# EAGLE design P6 ESTACIONMETEOROLOGICA (EAGLE 7.3.0)
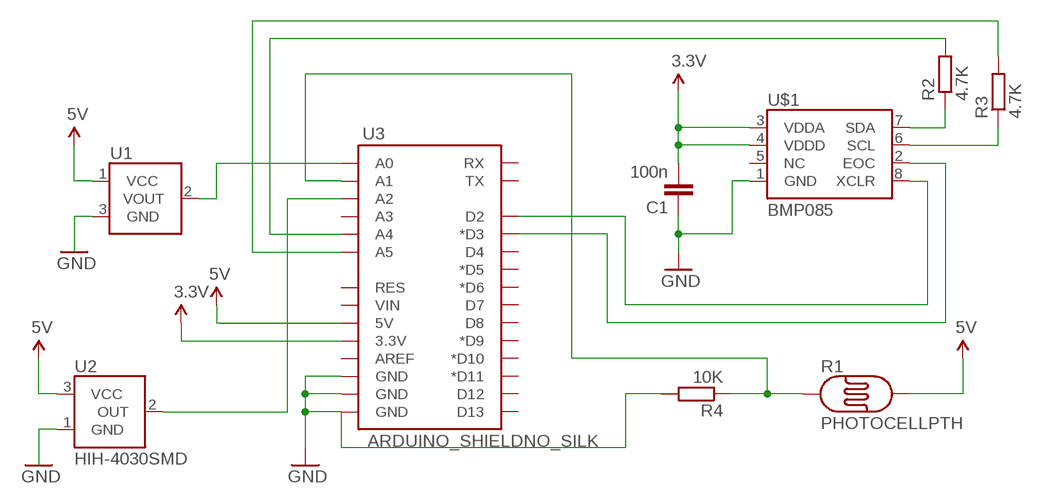
[diagram p0: schematic, sheet 1]

## Parts
C1  100n  C  [C0805]
R1  PHOTOCELLPTH  [PHOTOCELL]
R2  4.7K  R  [R0805]
R3  4.7K  R  [R0805]
R4  10K  R  [R0805]
U1  TMP36GT9  [TO-92]
U2  HIH-4030SMD  [HIH-4030]
U3  ARDUINO_SHIELDNO_SILK  [DUEMILANOVE_VIAS]
U$1  BMP085  [BMP085]

## Nets
3.3V: C1.2 U3.3.3V U$1.3(VDDA) U$1.4(VDDD)
5V: R1.2 U1.1(VCC) U2.3(VCC) U3.5V
GND: C1.1 U3.GND@0(GND) U3.GND@1(GND) U3.GND@2(GND) U$1.1(GND)
N$1: R2.1 U$1.7(SDA)
N$2: R2.2 U3.A4
N$3: R3.1 U$1.6(SCL)
N$4: R3.2 U3.A5
N$6: U3.D2 U$1.8(XCLR)
N$7: U3.D3(*D3) U$1.2(EOC)
N$8: R1.1 R4.1 U3.A1
N$9: U2.2(OUT) U3.A2
N$10: U2.1(GND)
N$11: U1.3(GND)
N$12: U1.2(VOUT) U3.A0
Unconnected: R4.2 U3.A3 U3.AREF U3.D4 U3.D5(*D5) U3.D6(*D6) U3.D7 U3.D8 U3.D9(*D9) U3.D10(*D10) U3.D11(*D11) U3.D12 U3.D13 U3.RES U3.RX U3.TX U3.VIN U$1.5(NC)

## Library data of the parts
C1 = eagle-ltspice:C: CAPACITOR, European symbol; SPICEMODEL: NONE; SPICEPREFIX: C
R1 = SparkFun-Sensors:PHOTOCELL: CdS photoresistor. This is a low cost way to detect light levels. Resistance decreases with more incoming light. SparkFun SKU: SEN-09088
R2-R4 = eagle-ltspice:R: RESISTOR, European symbol; SPICEMODEL: NONE; SPICEPREFIX: R
U1 = SparkFun-Sensors:TMP36: Precision degC temp sensor, analog out
U2 = SparkFun-Sensors:HIH-4030: Humidity Sensor
U3 = SparkFun-Boards:ARDUINO_SHIELD: Arduino shield footprint
U$1 = SparkFun-Sensors:BMP085: BMP085 Pressure Sensor Great little MEMS pressure sensor. SKU: COM-09603

## Board
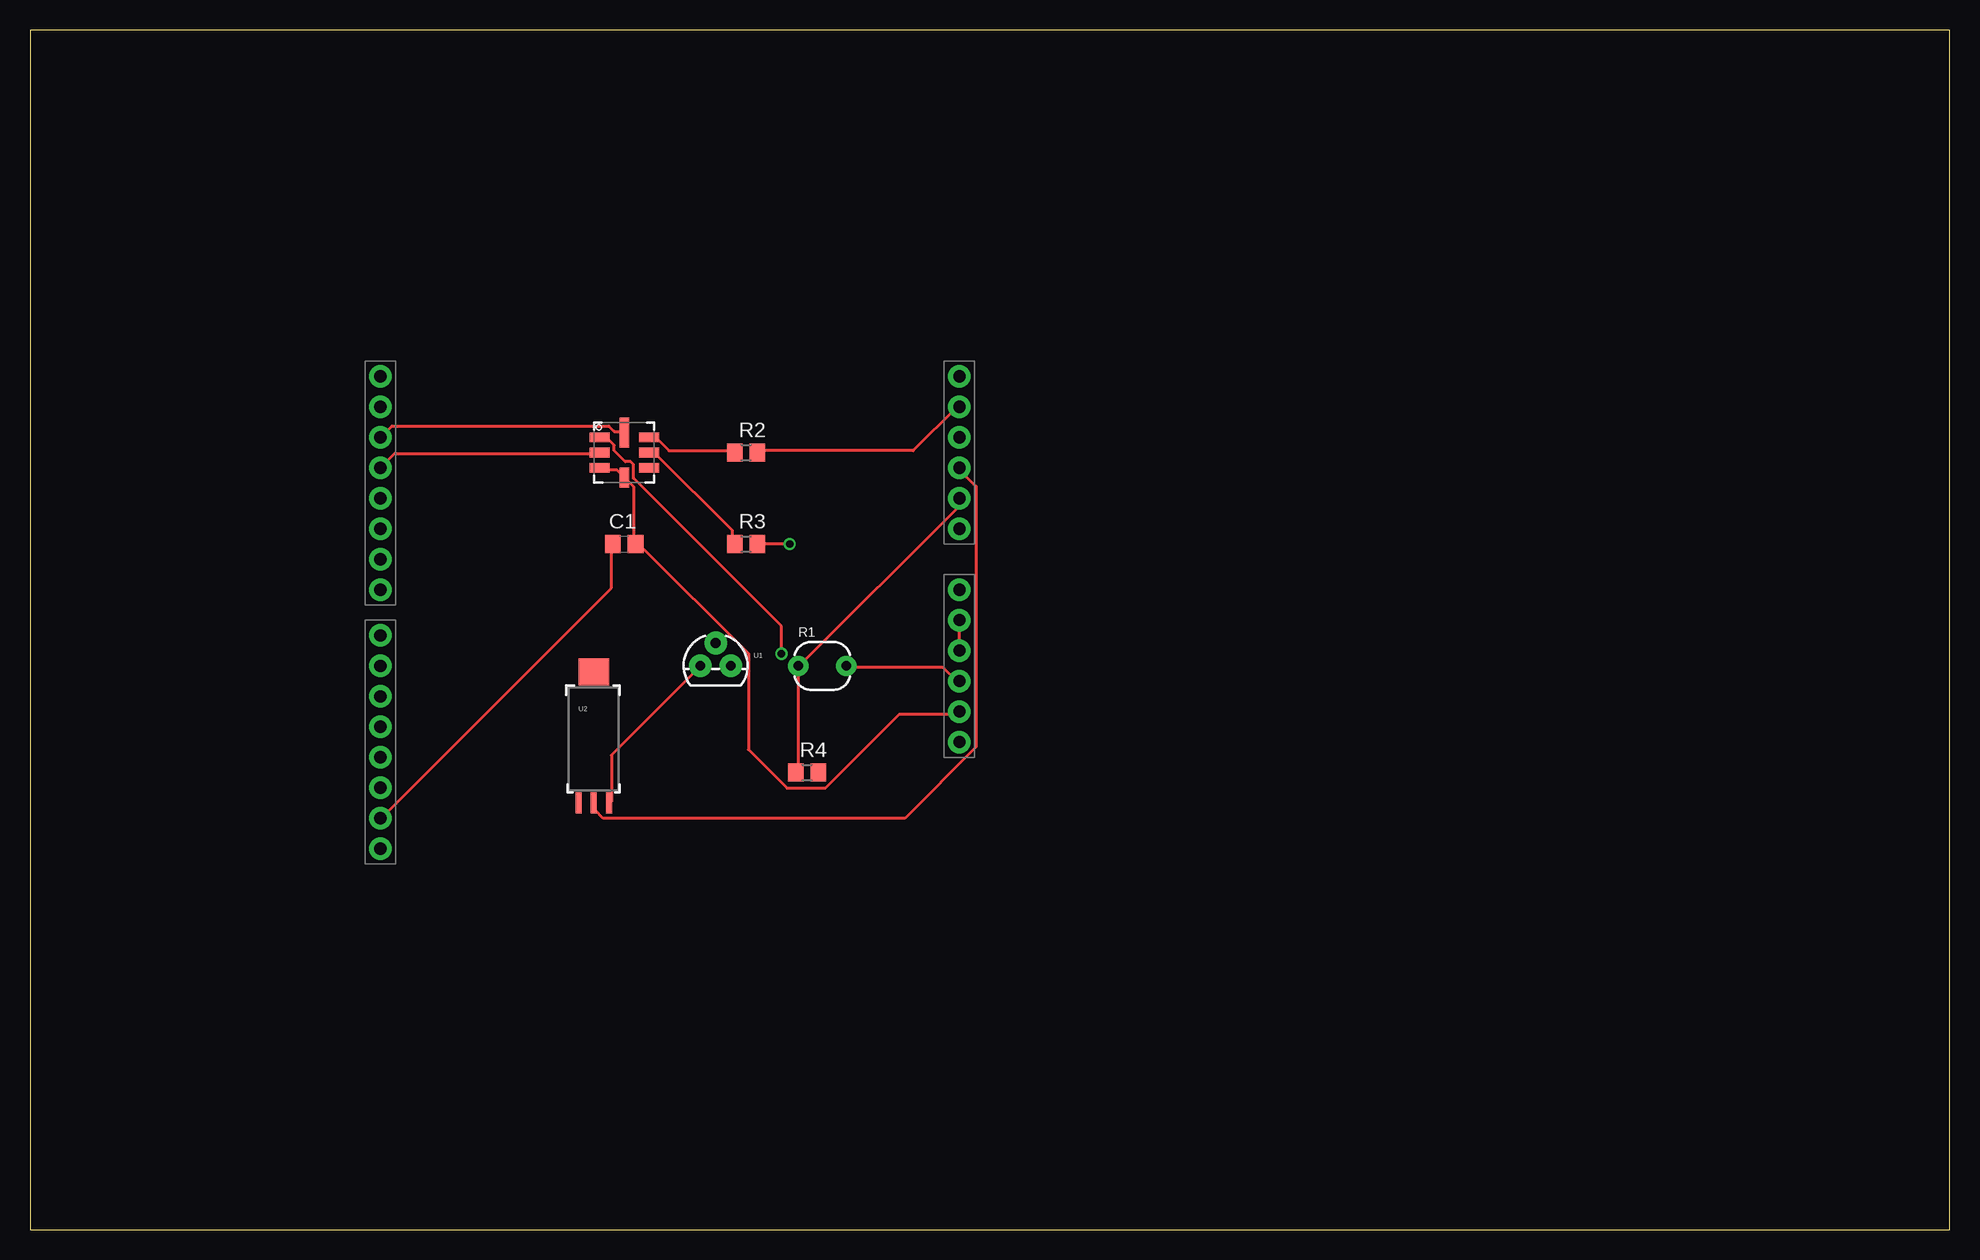
[diagram p1: board, top side]
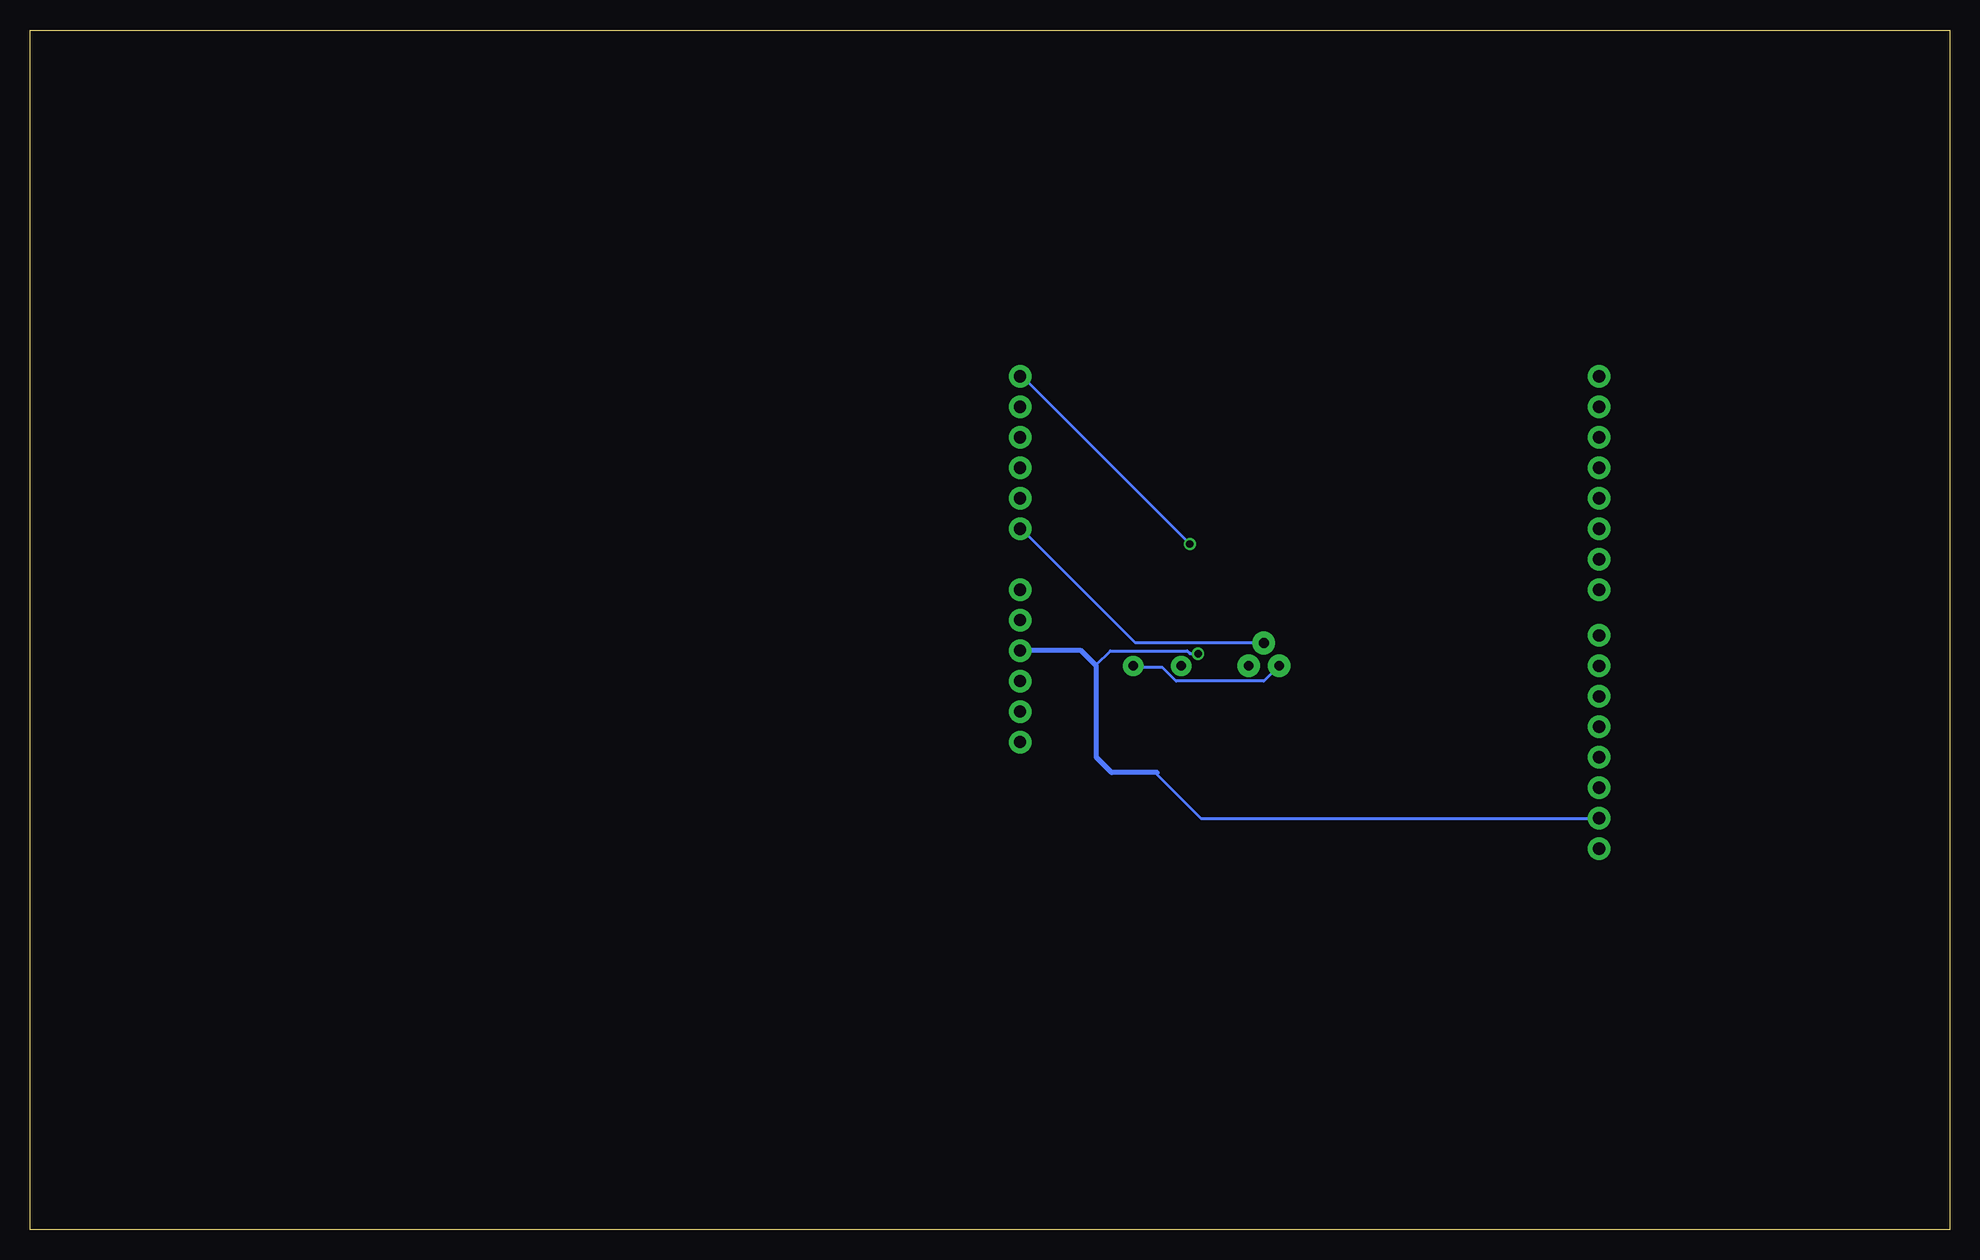
[diagram p2: board, bottom side, seen from below]

Size 160 x 100 mm. Coordinates in mm from the lower left corner, seen from the top.
Outline: 0,0 160,0 160,100 0,100 0,0
Copper layers (1*16): Top 0.035mm / dielectric 1.5mm / Bottom 0.035mm
Design rules "default": minimum track width 10mil, minimum drill 24mil, track to track 8mil, track to pad 8mil, pad to pad 8mil, via to via 8mil, smd to smd 8mil, copper to edge 40mil, drill to drill 8mil, minimum pad ring 10mil, minimum via ring 8mil, stop-mask expansion 4mil, vias tented up to drill 0mil, thermal gap 10mil

### Footprints (pad centres in the part's own frame; a part is rotated, then mirrored left to right if it is on the bottom)
C0805 = smd 1.3 x 1.5: 1 -0.95,0; 2 0.95,0
PHOTOCELL = drill 0.8 pad 1.676: 1 -2,0; 2 2,0
R0805 = smd 1.3 x 1.5: 1 -0.95,0; 2 0.95,0
TO-92 = drill 0.813 pad 1.88: 1 -1.27,0; 2 0,1.905; 3 1.27,0
HIH-4030 = smd 0.508 x 1.778: 1 -1.27,-5.08; 2 0,-5.08; 3 1.27,-5.08 | smd 2.54 x 2.286: NC 0,5.842
DUEMILANOVE_VIAS = drill 1.016 pad 1.88: 3.3V 50.8,13.97; 5V 50.8,16.51; A0 50.8,29.21; A1 50.8,31.75; A2 50.8,34.29; A3 50.8,36.83; A4 50.8,39.37; A5 50.8,41.91; AREF 2.54,2.54; D2 2.54,36.83; D3 2.54,34.29; D4 2.54,31.75; D5 2.54,29.21; D6 2.54,26.67; D7 2.54,24.13; D8 2.54,20.32; D9 2.54,17.78; D10 2.54,15.24; D11 2.54,12.7; D12 2.54,10.16; D13 2.54,7.62; GND@0 50.8,19.05; GND@1 50.8,21.59; GND@2 2.54,5.08; RES 50.8,11.43; RX 2.54,41.91; TX 2.54,39.37; VIN 50.8,24.13
BMP085 = smd 1.67 x 0.8: 1 -2.065,1.27; 2 -2.065,0; 3 -2.065,-1.27; 5 2.065,-1.27; 6 2.065,0; 7 2.065,1.27 | smd 0.8 x 1.67: 4 0,-2.065 | smd 0.8 x 2.5: 8 0,1.65

### Placement (x,y rotation side)
C1  49.53,57.15 0 top
R1  66.04,46.99 0 top
R2  59.69,64.77 0 top
R3  59.69,57.15 0 top
R4  64.77,38.1 0 top
U1  57.15,46.99 0 top
U2  46.99,40.64 0 top
U3  26.67,29.21 0 top
U$1  49.53,64.77 0 top

### Tracks (layer width: path | path; a pad name or v marks a point on that pad's centre or on a via)
3.3V
  Top 0.254: U$1.3 47.55,63.32 48.92,63.32 49.38,62.87 U$1.4 49.61,62.64 50.29,61.95 50.29,57.15 C1.2 50.75,57.15 59.89,48.01 59.89,40.01 63.09,36.8 66.29,36.8 72.47,42.98 77.27,42.98 U3.3.3V
5V
  Top 0.254: R1.2 68.12,46.86 76.12,46.86 77.27,45.72 U3.5V | U2.3 48.46,35.66 48.46,39.55 55.78,46.86 U1.1
  Bottom 0.254: U1.1 57.15,45.72 64.47,45.72 65.61,46.86 67.89,46.86 R1.2
GND  (via drill 0.61)
  Top 0.254: C1.1 48.46,57.15 48.46,53.49 29.26,34.29 U3.GND@2 | v62.64,48.01 62.64,50.29 50.29,62.64 50.29,63.78 50.06,64.01 49.61,64.01 48.69,64.92 48.69,65.38 48.23,65.84 47.55,65.84 U$1.1 | U3.GND@1 77.5,50.75 77.5,48.46 U3.GND@0
  Bottom 0.254: v62.64,48.01 63.32,48.01 63.55,48.23 69.95,48.23 71.09,47.09 71.12,46.99 | U3.GND@2 62.41,34.29 66.06,37.95 66.06,38.1
  Bottom 0.406: 66.04,38.1 66.06,38.1 69.85,38.1 71.12,39.37 71.12,46.99 72.39,48.26 U3.GND@0
N$1
  Top 0.254: R2.1 58.52,64.92 53.26,64.92 52.35,65.84 51.66,65.84 U$1.7
N$2
  Top 0.254: R2.2 60.81,64.92 73.61,64.92 77.27,68.58 U3.A4
N$3
  Top 0.254: R3.1 58.52,57.15 58.52,58.29 52.12,64.69 51.66,64.69 U$1.6
N$4  (via drill 0.61)
  Top 0.254: v63.32,57.15 R3.2
  Bottom 0.254: v63.32,57.15 77.27,71.09 U3.A5
N$6
  Top 0.254: U$1.8 49.38,66.52 48.69,66.52 48.23,66.98 30.18,66.98 29.26,66.06 U3.D2
N$7
  Top 0.254: U3.D3 30.4,64.69 47.32,64.69 U$1.2
N$8
  Top 0.254: R4.1 64.01,38.18 64.01,46.86 R1.1 64.24,47.09 77.27,60.12 77.27,60.81 U3.A1
N$9
  Top 0.254: U2.2 47.09,35.43 47.09,34.98 47.78,34.29 72.92,34.29 78.87,40.23 78.87,61.95 77.5,63.32 U3.A2
N$12
  Bottom 0.254: U1.2 57.15,48.92 67.89,48.92 77.27,58.29 U3.A0